# EAGLE design PS_2013v11 (EAGLE 6.5.0)
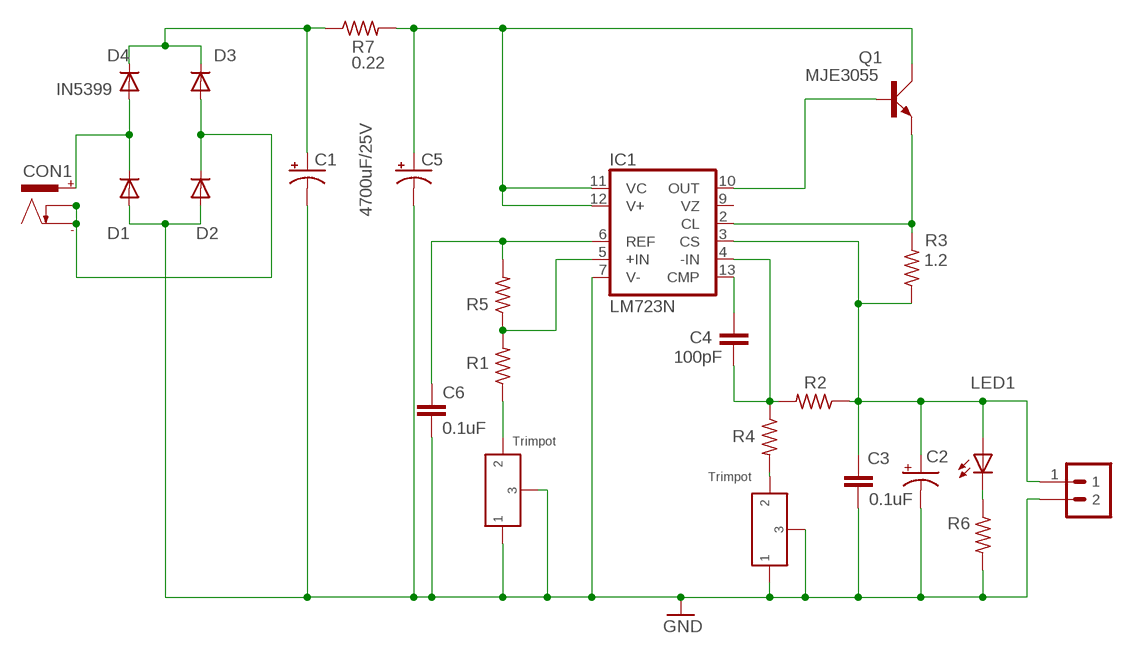
[diagram p0: schematic, sheet 1]

## Parts
C1  CPOL-USE7.5-18  [E7,5-18]
C2  CPOL-USE2,5-6E  [E2,5-6E]
C3  0.1uF  C-EU050-024X044  [C050-024X044]
C4  100pF  C-EU050-024X044  [C050-024X044]
C5  4700uF/25V  CPOL-USE7.5-18  [E7,5-18]
C6  0.1uF  C-EU050-024X044  [C050-024X044]
CON1  POWER_CON  [NEB21R]
D1  IN5399  DIODE-DO15-12  [DO15-12]
D2  IN5399  DIODE-DO15-12  [DO15-12]
D3  IN5399  DIODE-DO15-12  [DO15-12]
D4  IN5399  DIODE-DO15-12  [DO15-12]
IC1  LM723N  [DIL14]
LED1  LED3MM  [LED3MM]
Q1  MJE3055  [TO220AV]
R1  560k  R-US_0204/5  [0204/5]
R2  300k  R-US_0204/5  [0204/5]
R3  1.2  R-US_0617/22  [0617/22]
R4  300k  R-US_0204/5  [0204/5]
R5  220k  R-US_0204/5  [0204/5]
R6  330  R-US_0204/5  [0204/5]
R7  0.22  R-US_0617/22  [0617/22]
U$1  PRESET  [PRESET_PACK]
U$3  PRESET  [PRESET_PACK]
U$4  1X2_LR  [1X2_LR]

## Nets
N$1: IC1.5(+IN) R1.2 R5.1
N$2: C6.1 IC1.6(REF) R5.2
N$3: IC1.10(OUT) Q1.B
N$4: C4.1 IC1.13(CMP)
N$5: IC1.2(CL) Q1.E R3.2
N$6: C1.+ D3.C D4.C R7.1
N$7: R1.1 U$1.P$2
N$9: C4.2 IC1.4(-IN) R2.2 R4.1
N$10: C5.+ IC1.11(VC) IC1.12(V+) Q1.C R7.2
N$11: R4.2 U$3.P$2
N$14: LED1.K(C) R6.1
N$15: CON1.+ D1.C D4.A
N$18: C2.+ C3.1 IC1.3(CS) LED1.A R2.1 R3.1 U$4.1
N$23: CON1.- CON1.C D2.C D3.A
PRESET2: C1.- C2.- C3.2 C5.- C6.2 D1.A D2.A IC1.7(V-) R6.2 U$1.P$1 U$1.P$3 U$3.P$1 U$3.P$3 U$4.2 ; supply symbol labelled GND
Unconnected: IC1.9(VZ)

## Notes on the sheet
- Trimpot
- Trimpot

## Library data of the parts
C1 C2 C5 = adafruit:CPOL-US: POLARIZED CAPACITOR, American symbol
C3 C4 C6 = rcl:C-EU: CAPACITOR, European symbol
CON1 = CEDTv32:POWER_CON: DC Power Connector
D1-D4 = diode:DIODE-: DIODE
IC1 = linear:*723: Positive VOLTAGE REGULATOR
LED1 = led:LED: LED OSRAM: - CHIPLED LG R971, LG N971, LY N971, LG Q971, LY Q971, LO R971, LY R971 LH N974, LH R974 LS Q976, LO Q976, LY Q976 LO Q996 - Hyper CHIPLED LW Q18S LB Q993, LB Q99A, LB R99A - SideLED LS A670, LO A670, LY A670, LG A670, LP A670 LB A673, LV A673, LT A673, LW A673 LH A674 LY A675 LS A676, LA A676, LO A676, LY A676, LW A676 LS A679, LY A679, LG A679 - Hyper Micro SIDELED® LS Y876, LA Y876, LO Y876, LY Y876 LT Y87S - SmartLED LW L88C, LW L88S LB L89C, LB L89S, LG L890 LS L89K, LO L89K, LY L89K LS L896, LA L896, LO L896, LY L896 - TOPLED LS T670, LO T670, LY T670, LG T670, LP T670 LSG T670, LSP T670, LSY T670, LOP T670, LYG T670 LG T671, LOG T671, LSG T671 LB T673, LV T673, LT T673, LW T673 LH T674 LS T676, LA T676, LO T676, LY T676, LB T676, LH T676, LSB T676, LW T676 LB T67C, LV T67C, LT T67C, LS T67K, LO T67K, LY T67K, LW E67C LS E67B, LA E67B, LO E67B, LY E67B, LB E67C, LV E67C, LT E67C LW T67C LS T679, LY T679, LG T679 LS T770, LO T770, LY T770, LG T770, LP T770 LB T773, LV T773, LT T773, LW T773 LH T774 LS E675, LA E675, LY E675, LS T675 LS T776, LA T776, LO T776, LY T776, LB T776 LHGB T686 LT T68C, LB T68C - Hyper Mini TOPLED® LB M676 - Mini TOPLED Santana® LG M470 LS M47K, LO M47K, LY M47K Source: http://www.osram.convergy.de LUXEON: - LUMILED® LXK2-PW12-R00, LXK2-PW12-S00, LXK2-PW14-U00, LXK2-PW14-V00 LXK2-PM12-R00, LXK2-PM12-S00, LXK2-PM14-U00 LXK2-PE12-Q00, LXK2-PE12-R00, LXK2-PE12-S00, LXK2-PE14-T00, LXK2-PE14-U00 LXK2-PB12-K00, LXK2-PB12-L00, LXK2-PB12-M00, LXK2-PB14-N00, LXK2-PB14-P00, LXK2-PB14-Q00 LXK2-PR12-L00, LXK2-PR12-M00, LXK2-PR14-Q00, LXK2-PR14-R00 LXK2-PD12-Q00, LXK2-PD12-R00, LXK2-PD12-S00 LXK2-PH12-R00, LXK2-PH12-S00 LXK2-PL12-P00, LXK2-PL12-Q00, LXK2-PL12-R00 Source: www.luxeon.com KINGBRIGHT: KA-3528ASYC Source: www.kingbright.com
Q1 = transistor-power:MJE3055: NPN TRANSISTOR
R1-R7 = rcl:R-US_: RESISTOR, American symbol
U$1 U$3 = CEDTv44:PRESET
U$4 = CEDT_December_2014:1X2_LR

## Board
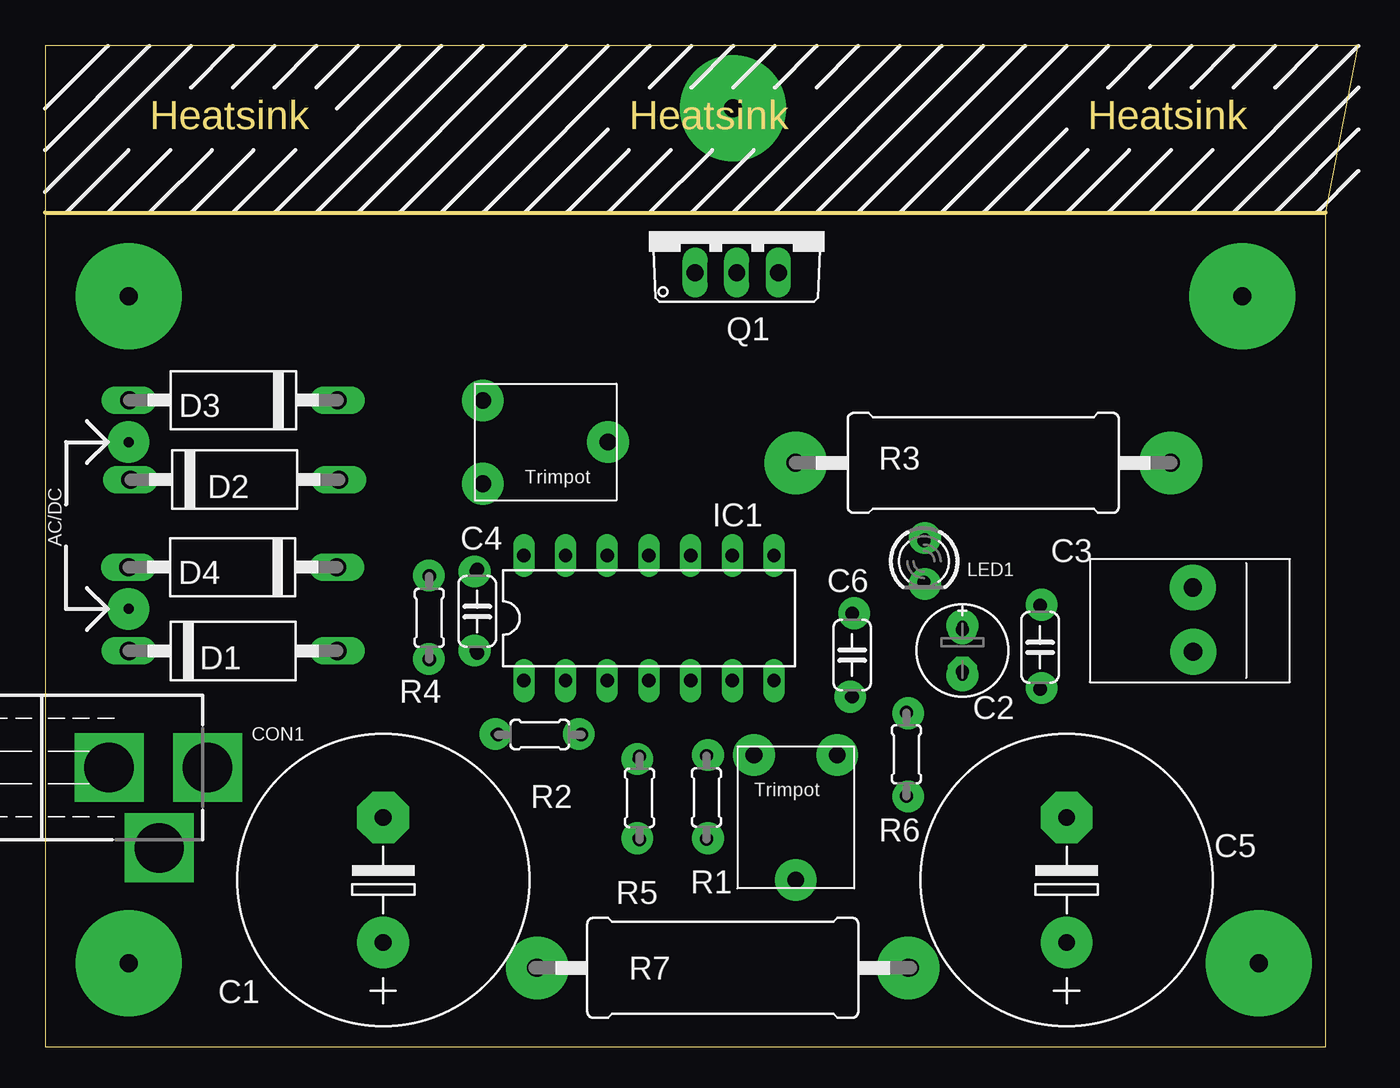
[diagram p1: board, top side]
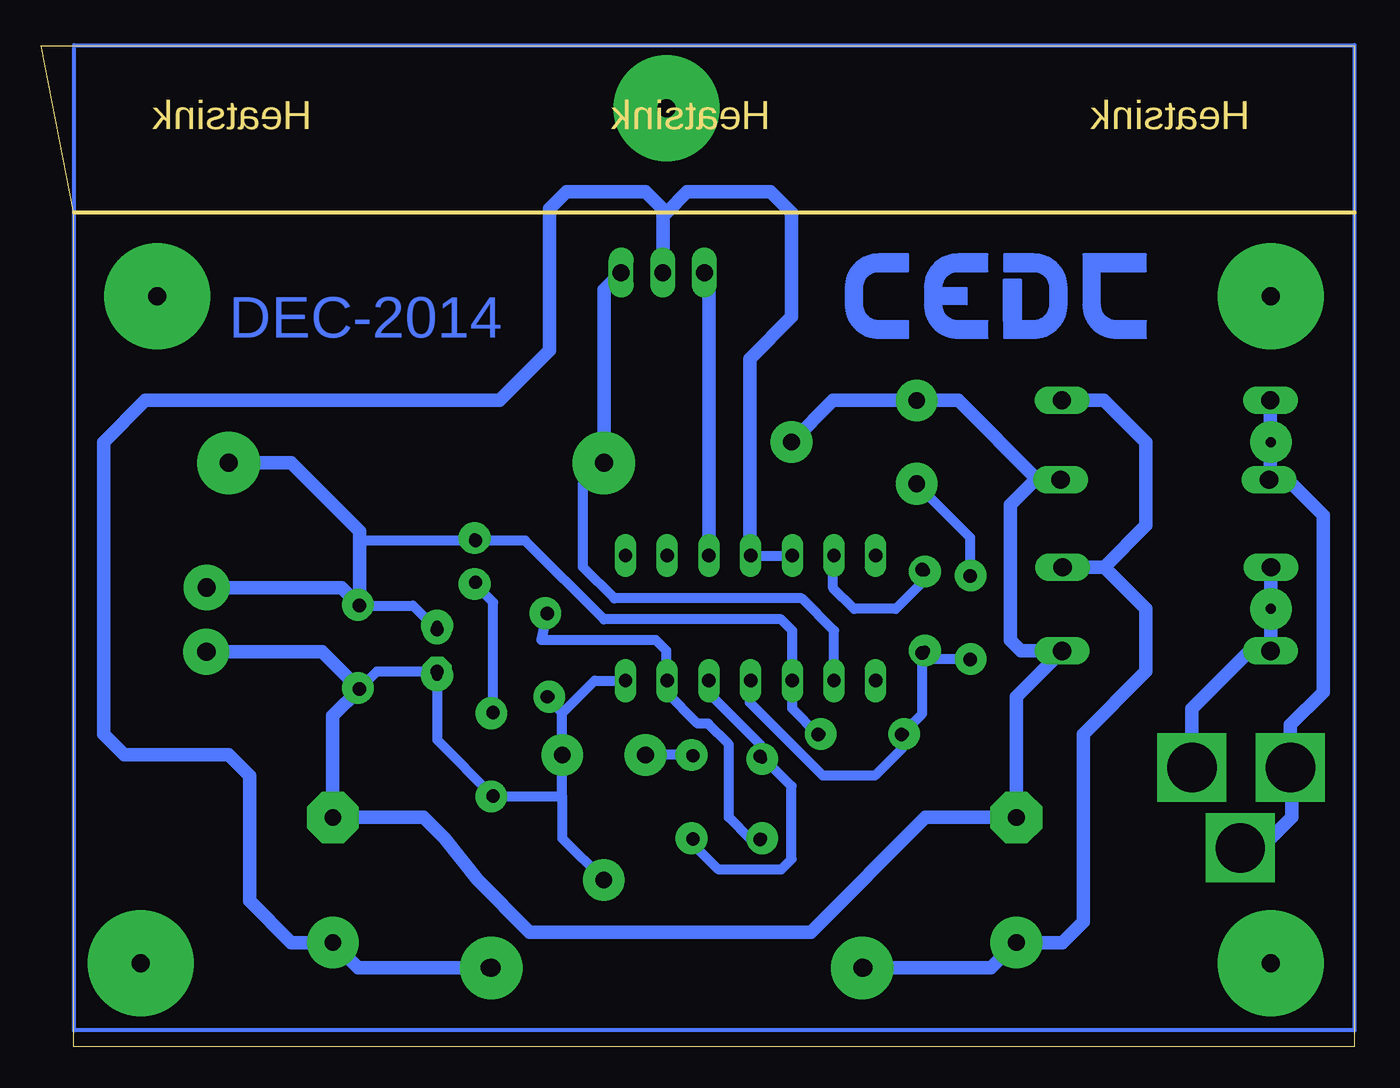
[diagram p2: board, bottom side, seen from below]

Size 80.01 x 60.96 mm. Coordinates in mm from the lower left corner, seen from the top.
Outline: 78.01,50.8 78.01,0 0,0 0,50.8
Outline: 78.01,50.8 80.01,60.96 0,60.96 0,50.8
Outline: 0,50.8 78.01,50.8
Copper layers (1*16): Top 0.035mm / dielectric 1.5mm / Bottom 0.035mm
Design rules "default *": minimum track width 50mil, minimum drill 24mil, track to track 8mil, track to pad 8mil, pad to pad 8mil, via to via 8mil, smd to smd 8mil, copper to edge 40mil, drill to drill 8mil, minimum pad ring 10mil, minimum via ring 8mil, stop-mask expansion 4mil, vias tented up to drill 0mil, thermal gap 10mil

### Footprints (pad centres in the part's own frame; a part is rotated, then mirrored left to right if it is on the bottom)
E7,5-18 = drill 1.016 pad 3.15: + -3.81,0 | drill 1.016 pad 3.15 octagon: - 3.81,0
E2,5-6E = drill 0.813 pad 1.778: + -1.27,0 | drill 0.813 pad 1.778 octagon: - 1.27,0
C050-024X044 = drill 0.813 octagon: 1 -2.54,0; 2 2.54,0
NEB21R = drill 3 pad 4.2 square: + 0,3.54; - 0,-2.46; C 4.9,0.59
DO15-12 = drill 1.118 long: A 6.35,0; C -6.35,0
DIL14 = drill 0.813 long: 1 -7.62,-3.81; 2 -5.08,-3.81; 3 -2.54,-3.81; 4 0,-3.81; 5 2.54,-3.81; 6 5.08,-3.81; 7 7.62,-3.81; 8 7.62,3.81; 9 5.08,3.81; 10 2.54,3.81; 11 0,3.81; 12 -2.54,3.81; 13 -5.08,3.81; 14 -7.62,3.81
LED3MM = drill 0.813 octagon: A -1.27,0; K 1.27,0
TO220AV = drill 1.016 long: B -2.54,-2.54; C 0,-2.54; E 2.54,-2.54
0204/5 = drill 0.813 octagon: 1 -2.54,0; 2 2.54,0
0617/22 = drill 1.016 octagon: 1 -11.43,0; 2 11.43,0
PRESET_PACK = drill 1.016 pad 2.54: P$1 -2.54,-3.81; P$2 2.54,-3.81; P$3 0,3.81
1X2_LR = drill 1.12 pad 2.794: 1 -1.971,1.92; 2 1.938,1.94

### Placement (x,y rotation side)
C1  20.59,10.16 90 top
C2  55.88,24.13 270 top
C3  60.61,24.33 270 top
C4  26.32,26.52 270 top
C5  62.23,10.16 90 top
C6  49.16,23.86 270 top
CON1  6.35,17.01 270 top
D1  11.45,24.11 0 top
D2  11.54,34.54 0 top
D3  11.46,39.38 180 top
D4  11.43,29.21 180 top
IC1  36.78,26.11 0 top
LED1  53.54,29.57 270 top
Q1  42.13,49.69 0 top
R1  40.28,15.19 270 top
R2  30.13,19.02 180 top
R3  57.15,35.56 180 top
R4  23.39,26.13 90 top
R5  36.21,15.16 270 top
R6  52.47,17.82 270 top
R7  41.28,4.81 0 top
U$1  45.72,13.97 180 top
U$2  [LOGO-CEDT-BOT-18MM]  12.7,43.18 0 top
U$3  30.48,36.83 270 top
U$4  68,26 270 top

### Tracks (layer width: path | path; a pad name or v marks a point on that pad's centre or on a via)
N$1
  Bottom 0.61: IC1.5 39.32,21.54 36.2,18.41 36.2,17.71 R5.1 36.12,17.7 34.29,15.88 34.29,11.43 34.92,10.79 38.73,10.79 40.28,12.35 R1.2
N$2
  Bottom 0.61: R5.2 36.75,12.62 38.1,13.97 38.1,18.41 39.37,19.68 40.01,19.68 41.91,21.59 41.91,22.25 | 41.91,22.25 IC1.6 | 41.91,22.25 41.91,24.13 42.55,24.77 49.53,24.77 C6.1
N$3
  Bottom 0.813: IC1.10 39.32,46.88 Q1.B
N$4
  Bottom 0.61: C4.1 26.32,28.29 27.94,26.67 30.48,26.67 31.75,27.94 31.75,29.87 IC1.13
N$5
  Bottom 0.61: IC1.2 31.7,25.35 33.66,27.3 45.09,27.3 46.99,29.21 46.99,34.29 R3.2
  Bottom 0.813: R3.2 45.72,46.09 Q1.E
N$6
  Bottom 0.813: R7.1 22.13,4.81 C1.+ 17.78,6.35 16.51,7.62 16.51,19.05 12.7,22.86 12.7,26.67 15.24,29.21 | D3.C 15.25,39.38 12.7,36.83 12.7,31.75 15.24,29.21 | 15.24,29.21 D4.C
N$7  (via drill 0.6 pad 1.93)
  Bottom 0.61: U$1.P$2 v40.39,17.78 40.34,17.78 R1.1
N$8  (via drill 1.1 pad 6.45)
  other vias: 41.91,57.15
N$9
  Bottom 0.61: IC1.4 36.83,22.25 36.83,20.95 32.38,16.51 29.21,16.51 27.59,18.13 R2.2 26.32,20.29 C4.2 25.93,23.59 R4.1
N$10
  Bottom 0.61: IC1.12 IC1.11 36.78,30.43 36.83,30.48
  Bottom 0.813: Q1.C 42.13,50.58 41.91,50.8 | 41.91,50.8 40.64,52.07 35.56,52.07 34.29,50.8 34.29,44.45 36.83,41.91 36.83,30.48 36.83,29.97 | R7.2 60.69,4.81 C5.+ 64.77,6.35 67.31,8.89 67.31,16.51 68.58,17.78 74.93,17.78 76.2,19.05 76.2,36.83 73.66,39.37 52.07,39.37 49.02,42.42 49.02,51.05 48.01,52.07 43.18,52.07 41.91,50.8
N$11
  Bottom 0.61: R4.2 23.39,31.02 U$3.P$2
N$12  (via drill 1.1 pad 6.45)
  other vias: 72.93,45.72
N$13  (via drill 1.1 pad 6.45)
  other vias: 5.08,45.72
N$14
  Bottom 0.61: LED1.K 53.54,28.14 52.47,27.07 R6.1
N$15  (via drill 0.6 pad 2.54)
  Bottom 0.813: D4.A v5.08,26.67 5.08,24.13 D1.C 6.37,24.11 9.89,20.59 CON1.+
N$16  (via drill 1.1 pad 6.45)
  other vias: 73.93,5.08
N$17  (via drill 1.1 pad 6.45)
  other vias: 5.08,5.08
N$18
  Bottom 0.61: R2.1 34.24,20.59 IC1.3 34.24,25.35 34.92,26.04 45.72,26.04 50.52,30.84 LED1.A 60.26,30.84 60.61,30.48 | C3.1 57.35,26.87 C2.+
  Bottom 0.813: R3.1 64.77,35.56 60.61,31.4 60.61,30.48 C3.1 61.71,27.97 U$4.1
N$21  (via drill 0.6 pad 1.93)
  other vias: 53.59,30.99
N$22  (via drill 0.6 pad 1.93)
  other vias: 53.59,28.19
N$23
  Bottom 0.813: CON1.C 5.67,12.11 3.81,13.97 3.81,16.93 CON1.- 3.89,19.61 1.91,21.59 1.91,32.38 4.06,34.54 D2.C 5.12,34.62 D3.A
N$24  (via drill 0.6 pad 1.93)
  other vias: 60.71,26.92
N$25  (via drill 0.6 pad 1.93)
  other vias: 60.71,21.84
N$26  (via drill 0.6 pad 1.93)
  other vias: 55.88,25.65
N$27  (via drill 0.6 pad 1.93)
  other vias: 52.58,20.32
N$28  (via drill 0.6 pad 1.93)
  other vias: 52.58,15.24
N$29  (via drill 0.6 pad 1.93)
  other vias: 49.29,26.4
N$30  (via drill 0.6 pad 1.93)
  other vias: 40.39,12.7
N$31  (via drill 0.6 pad 1.93)
  other vias: 36.07,12.7
N$32  (via drill 0.6 pad 1.93)
  other vias: 36.07,17.53
N$33  (via drill 0.6 pad 1.93)
  other vias: 27.43,19.05
N$34  (via drill 0.6 pad 1.93)
  other vias: 32.51,19.05
N$35  (via drill 0.6 pad 1.93)
  other vias: 23.37,23.62
N$36  (via drill 0.6 pad 1.93)
  other vias: 23.37,28.7
N$37  (via drill 0.6 pad 1.93)
  other vias: 26.16,28.96
N$38  (via drill 0.6 pad 1.93)
  other vias: 26.16,24.13
N$39  (via drill 0.6 pad 2.54)
  other vias: 5.08,36.83
N$40
  Bottom 0.254: 0,1 78,1 78,61 0,61 0,1
N$41  (via drill 1.1 pad 3.81)
  other vias: 3.81,17.02
N$42  (via drill 1.1 pad 3.81)
  other vias: 9.91,17.02 6.86,12.19 29.97,4.81 52.58,4.81 45.72,35.56 68.58,35.56
PRESET2  (via drill 0.6 pad 1.93)
  Bottom 0.61: IC1.7 46.28,22.3 48.26,20.32 | 48.26,20.32 U$1.P$1 48.26,15.24 | C3.2 59.54,22.86 C2.- v55.88,22.61 55.88,18.69 R6.2 48.3,15.28 48.26,15.24 | 48.26,20.32 v49.04,21.32 C6.2 | 48.26,15.24 48.26,12.7 U$1.P$3
  Bottom 0.813: U$3.P$3 31.75,39.37 U$3.P$1 24.13,39.37 19.3,34.54 D2.A 19.43,34.54 20.95,33.02 20.95,24.77 20.32,24.13 17.81,24.13 D1.A 20.59,21.32 C1.- 26.13,13.97 33.12,6.99 50.24,6.99 53.42,10.16 55.42,12.7 56.69,13.97 C5.- 62.23,20.17 C3.2 62.88,24.06 U$4.2

### Text on the board
Bottom: DEC-2014
Dimension: Heatsink | Heatsink | Heatsink
tPlace: Trimpot | AC/DC | Trimpot